# EAGLE design tqfp-sandwich (EAGLE 9.4.1)
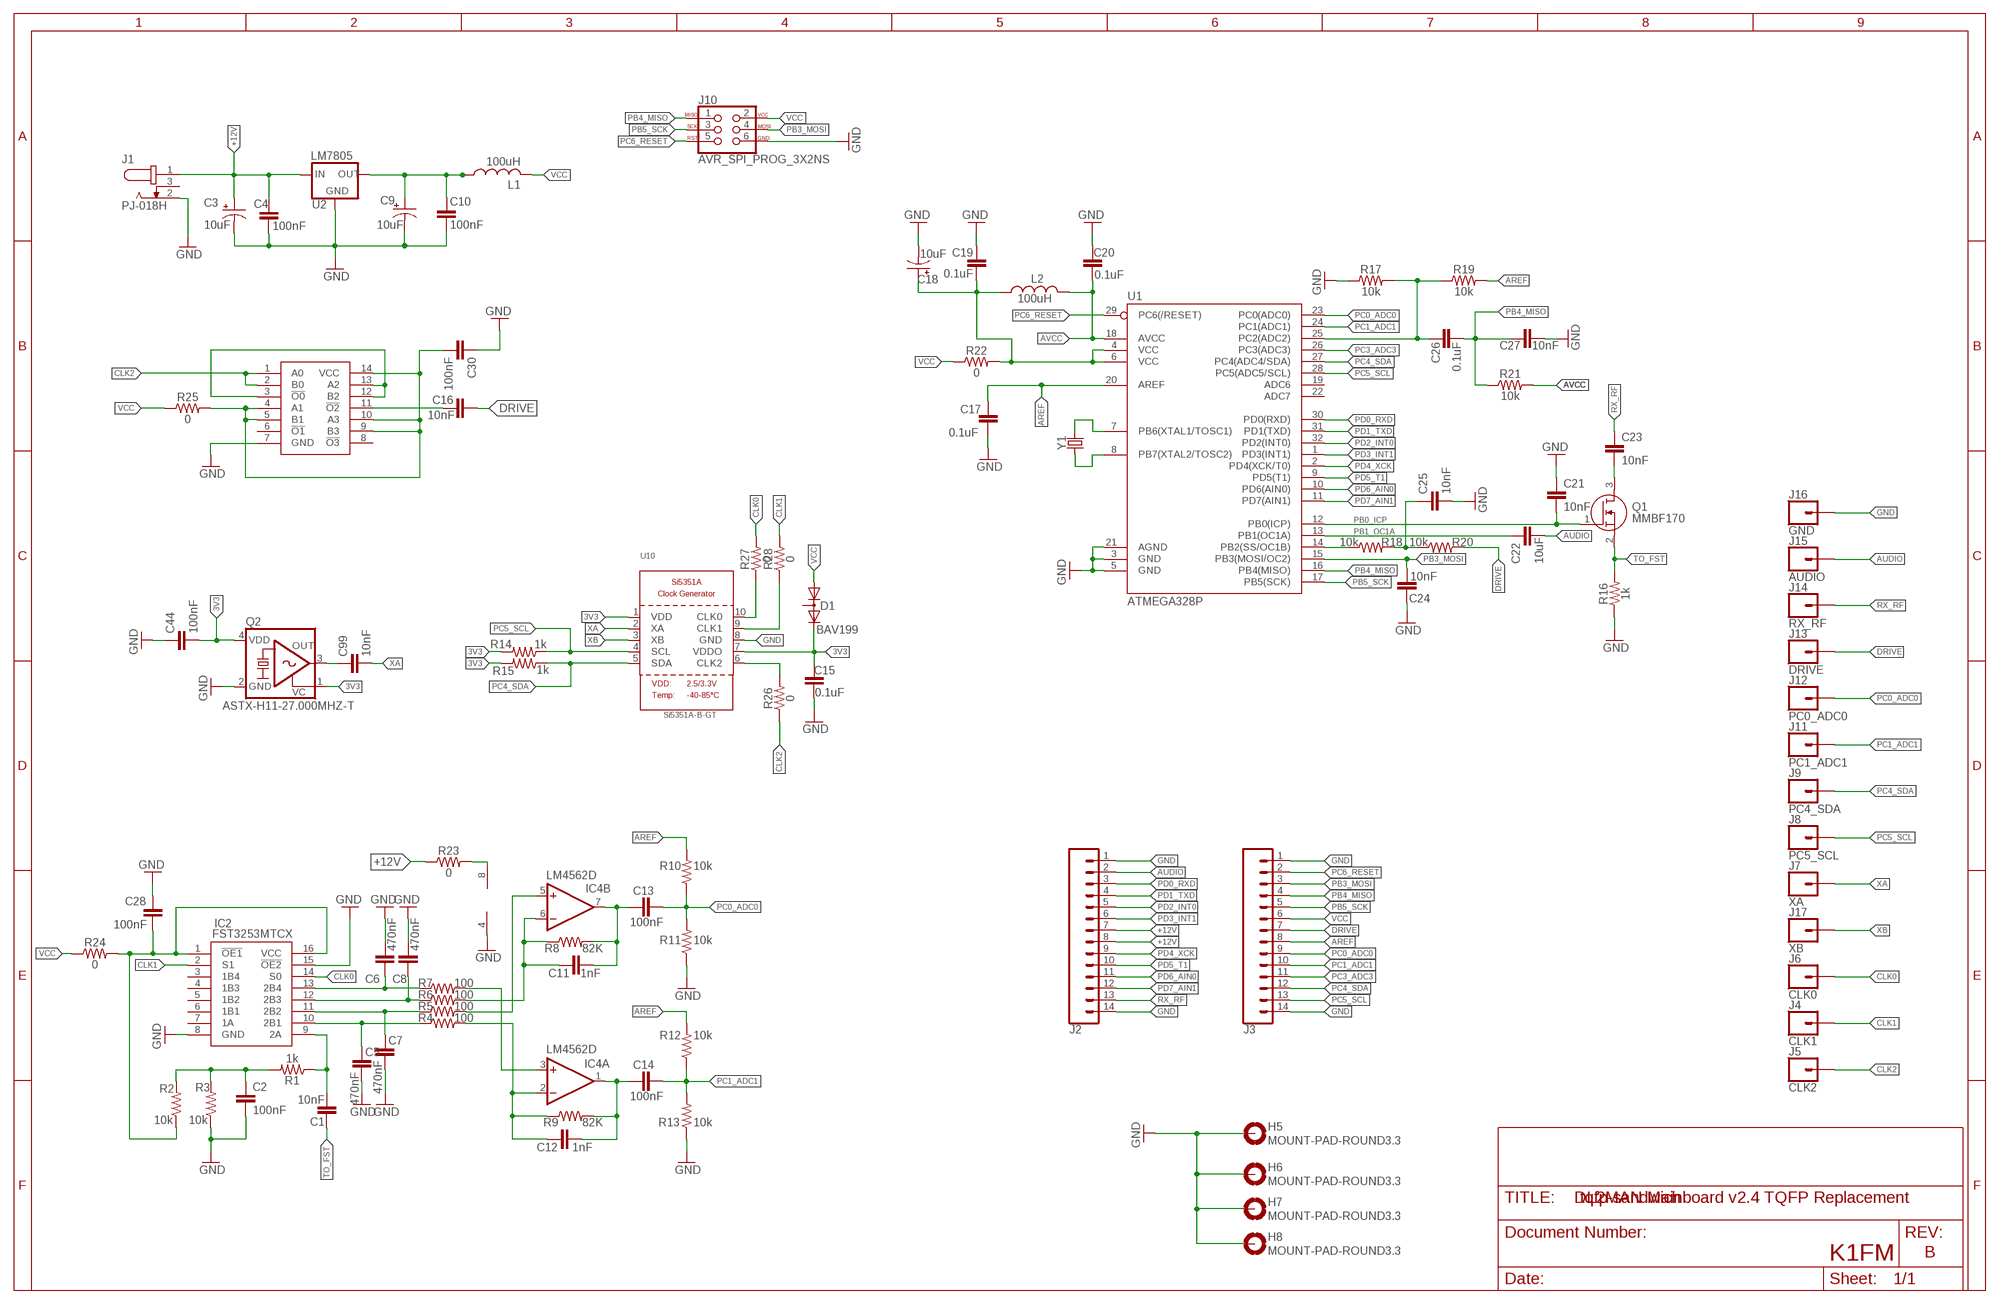
[diagram p0: schematic, sheet 1]

## Parts
C1  10nF  10NF-0603-50V-10%  [0603]
C2  100nF  10NF-0603-50V-10%  [0603]
C3  10uF  10UF-POLAR-EIA3216-16V-10%(TANT)  [EIA3216]
C4  100nF  10NF-0603-50V-10%  [0603]
C5  470nF  470PF-0603-50V-5%  [0603]
C6  470nF  470PF-0603-50V-5%  [0603]
C7  470nF  470PF-0603-50V-5%  [0603]
C8  470nF  470PF-0603-50V-5%  [0603]
C9  10uF  10UF-POLAR-EIA3216-16V-10%(TANT)  [EIA3216]
C10  100nF  10NF-0603-50V-10%  [0603]
C11  1nF  1.0NF/1000PF-0603-50V-10%  [0603]
C12  1nF  1.0NF/1000PF-0603-50V-10%  [0603]
C13  100nF  10NF-0603-50V-10%  [0603]
C14  100nF  10NF-0603-50V-10%  [0603]
C15  0.1uF  0.1UF-0603-25V-(+80/-20%)  [0603]
C16  10nF  10NF-0603-50V-10%  [0603]
C17  0.1uF  0.1UF-0603-25V-(+80/-20%)  [0603]
C18  10uF  10UF-POLAR-EIA3216-16V-10%(TANT)  [EIA3216]
C19  0.1uF  0.1UF-0603-25V-(+80/-20%)  [0603]
C20  0.1uF  0.1UF-0603-25V-(+80/-20%)  [0603]
C21  10nF  10NF-0603-50V-10%  [0603]
C22  10uF  10UF-0603-6.3V-20%  [0603]
C23  10nF  10NF-0603-50V-10%  [0603]
C24  10nF  10NF-0603-50V-10%  [0603]
C25  10nF  10NF-0603-50V-10%  [0603]
C26  0.1uF  0.1UF-0603-25V-(+80/-20%)  [0603]
C27  10nF  10NF-0603-50V-10%  [0603]
C28  100nF  10NF-0603-50V-10%  [0603]
C30  100nF  10NF-0603-50V-10%  [0603]
C44  100nF  10NF-0603-50V-10%  [0603]
C99  10nF  10NF-0603-50V-10%  [0603]
D1  BAV199  [SOT23]
H5  MOUNT-PAD-ROUND3.3  [3,3-PAD]
H6  MOUNT-PAD-ROUND3.3  [3,3-PAD]
H7  MOUNT-PAD-ROUND3.3  [3,3-PAD]
H8  MOUNT-PAD-ROUND3.3  [3,3-PAD]
IC2  FST3253MTCX  [SOP65P640X110-16N]
IC3  74ACT00MTC  [SOP65P640X120-14N]
IC4  LM4562D  [SO08]
J1  PJ-018H  [CUI_PJ-018H]
J2  CONN_14  [1X14]
J3  CONN_14  [1X14]
J4  CLK1  CONN_01PTH_LONGPAD  [1X01_LONGPAD]
J5  CLK2  CONN_01PTH_LONGPAD  [1X01_LONGPAD]
J6  CLK0  CONN_01PTH_LONGPAD  [1X01_LONGPAD]
J7  XA  CONN_01PTH_LONGPAD  [1X01_LONGPAD]
J8  PC5_SCL  CONN_01PTH_LONGPAD  [1X01_LONGPAD]
J9  PC4_SDA  CONN_01PTH_LONGPAD  [1X01_LONGPAD]
J10  AVR_SPI_PROG_3X2NS  [2X3-NS]
J11  PC1_ADC1  CONN_01PTH_LONGPAD  [1X01_LONGPAD]
J12  PC0_ADC0  CONN_01PTH_LONGPAD  [1X01_LONGPAD]
J13  DRIVE  CONN_01PTH_LONGPAD  [1X01_LONGPAD]
J14  RX_RF  CONN_01PTH_LONGPAD  [1X01_LONGPAD]
J15  AUDIO  CONN_01PTH_LONGPAD  [1X01_LONGPAD]
J16  GND  CONN_01PTH_LONGPAD  [1X01_LONGPAD]
J17  XB  CONN_01PTH_LONGPAD  [1X01_LONGPAD]
L1  100uH  INDUCTOR_0805_L  [RESC0805_L]
L2  100uH  INDUCTOR_0805_L  [RESC0805_L]
Q1  MMBF170  [SOT96P237X111-3N]
Q2  ASTX-H11-27.000MHZ-T  KXO-VCXO-SINE-84  [3.2X2.5_KXO-84]
R1  1k  1KOHM-0603-1/10W-1%  [0603]
R2  10k  10KOHM-0603-1/10W-1%  [0603]
R3  10k  10KOHM-0603-1/10W-1%  [0603]
R4  100  100OHM-0603-1/4W-5%  [0603]
R5  100  100OHM-0603-1/4W-5%  [0603]
R6  100  100OHM-0603-1/4W-5%  [0603]
R7  100  100OHM-0603-1/4W-5%  [0603]
R8  82K  82OHM-0603-1/10W-1%  [0603]
R9  82K  82OHM-0603-1/10W-1%  [0603]
R10  10k  10KOHM-0603-1/10W-1%  [0603]
R11  10k  10KOHM-0603-1/10W-1%  [0603]
R12  10k  10KOHM-0603-1/10W-1%  [0603]
R13  10k  10KOHM-0603-1/10W-1%  [0603]
R14  1k  1KOHM-0603-1/10W-1%  [0603]
R15  1k  1KOHM-0603-1/10W-1%  [0603]
R16  1k  1KOHM-0603-1/10W-1%  [0603]
R17  10k  10KOHM-0603-1/10W-1%  [0603]
R18  10k  10KOHM-0603-1/10W-1%  [0603]
R19  10k  10KOHM-0603-1/10W-1%  [0603]
R20  10k  10KOHM-0603-1/10W-1%  [0603]
R21  10k  10KOHM-0603-1/10W-1%  [0603]
R22  0  0OHM-0603-1/10W-5%  [0603]
R23  0  0OHM-0603-1/10W-5%  [0603]
R24  0  0OHM-0603-1/10W-5%  [0603]
R25  0  0OHM-0603-1/10W-5%  [0603]
R26  0  0OHM-0603-1/10W-5%  [0603]
R27  0  0OHM-0603-1/10W-5%  [0603]
R28  0  0OHM-0603-1/10W-5%  [0603]
U1  ATMEGA328P  ATMEGA328P_TQFP  [TQFP32-08]
U2  LM7805  V_REG_78XX7812  [TO-252]
U10  Si5351A-B-GT  SI5351A  [MSOP10]
Y1  CRYSTALSMD-5X3.2-2PAD  [CRYSTAL-SMD-5X3.2-2PAD]

## Nets
3V3: C15.2 C44.2 D1.2(C) Q2.1(VC) Q2.4(VDD) R14.2 R15.2 U10.1(VDD) U10.7(VDDO)
5V: C9.+ C10.2 L1.1 U2.2(OUT)
+12V: C3.+ C4.2 J1.1 J2.7 J2.8 R23.1 U2.1(IN)
AREF: C17.2 J3.8 R10.2 R12.2 R19.2 U1.20(AREF)
AUDIO: C22.2 J2.2 J15.1
AVCC: C20.1 L2.2 R21.2 U1.18(AVCC)
CLK0: IC2.14(S0) J6.1 R27.2
CLK1: IC2.2(S1) J4.1 R28.2
CLK2: IC3.1(A0) IC3.2(B0) J5.1 R26.1
DRIVE: C16.2 J3.7 J13.1 R20.2
GND: C2.2 C3.- C4.1 C5.2 C6.2 C7.2 C8.2 C9.- C10.1 C15.1 C17.1 C18.- C19.2 C20.2 C21.1 C24.1 C25.2 C27.2 C28.1 C30.1 C44.1 H5.B3,3(MOUNT) H6.B3,3(MOUNT) H7.B3,3(MOUNT) H8.B3,3(MOUNT) IC2.8(GND) IC2.15(!OE2) IC3.7(GND) IC4.4(P:V-) J1.2 J2.1 J2.14 J3.1 J3.14 J10.6 J16.1 Q2.2(GND) R3.1 R11.1 R13.1 R16.1 R17.1 U1.3(GND) U1.5(GND) U1.21(AGND) U2.3(GND) U10.8(GND)
N$1: U1.7(PB6(XTAL1/TOSC1)) Y1.P$2
N$2: U1.8(PB7(XTAL2/TOSC2)) Y1.P$1
N$3: C23.2 Q1.3(D)
N$4: C26.2 R17.2 R19.1 U1.25(PC2(ADC2))
N$5: IC3.3(!O0) IC3.12(B2) IC3.13(A2)
N$6: R18.1 U1.14(PB2(SS/OC1B))
N$7: C25.1 R18.2 R20.1
N$8: C99.1 Q2.3(OUT)
N$9: C5.1 IC2.10(2B1) R4.1
N$10: C16.1 IC3.11(!O2)
N$11: C18.+ C19.1 L2.1 R22.2 U1.4(VCC) U1.6(VCC)
N$12: C1.2 IC2.9(2A) R1.1
N$13: C2.1 R1.2 R2.2 R3.2
N$14: C7.1 IC2.11(2B2) R5.1
N$15: C8.1 IC2.12(2B3) R6.1
N$16: C6.1 IC2.13(2B4) R7.1
N$17: IC4.5(B:+IN) R5.2
N$18: C12.1 IC4.2(A:-IN) R4.2 R9.1
N$19: C11.1 IC4.6(B:-IN) R6.2 R8.1
N$20: IC4.3(A:+IN) R7.2
N$21: C11.2 C13.1 IC4.7(B:OUT) R8.2
N$22: C12.2 C14.1 IC4.1(A:OUT) R9.2
N$23: IC4.8(P:V+) R23.2
N$24: C28.2 IC2.1(!OE1) IC2.16(VCC) R2.1 R24.2
N$25: C30.2 IC3.4(A1) IC3.5(B1) IC3.9(B3) IC3.10(A3) IC3.14(VCC) R25.2
N$26: R27.1 U10.10(CLK0)
N$27: R28.1 U10.9(CLK1)
N$28: R26.2 U10.6(CLK2)
PB0_ICP: C21.2 Q1.1(G) U1.12(PB0(ICP))
PB1_OC1A: C22.1 U1.13(PB1(OC1A))
PB3_MOSI: C24.2 J3.3 J10.4 U1.15(PB3(MOSI/OC2))
PB4_MISO: C26.1 C27.1 J3.4 J10.1 R21.1 U1.16(PB4(MISO))
PB5_SCK: J3.5 J10.3 U1.17(PB5(SCK))
PC0_ADC0: C13.2 J3.9 J12.1 R10.1 R11.2 U1.23(PC0(ADC0))
PC1_ADC1: C14.2 J3.10 J11.1 R12.1 R13.2 U1.24(PC1(ADC1))
PC3_ADC3: J3.11 U1.26(PC3(ADC3))
PC4_SDA: J3.12 J9.1 R15.1 U1.27(PC4(ADC4/SDA)) U10.5(SDA)
PC5_SCL: J3.13 J8.1 R14.1 U1.28(PC5(ADC5/SCL)) U10.4(SCL)
PC6_RESET: J3.2 J10.5 U1.29(PC6(/RESET))
PD0_RXD: J2.3 U1.30(PD0(RXD))
PD1_TXD: J2.4 U1.31(PD1(TXD))
PD2_INT0: J2.5 U1.32(PD2(INT0))
PD3_INT1: J2.6 U1.1(PD3(INT1))
PD4_XCK: J2.9 U1.2(PD4(XCK/T0))
PD5_T1: J2.10 U1.9(PD5(T1))
PD6_AIN0: J2.11 U1.10(PD6(AIN0))
PD7_AIN1: J2.12 U1.11(PD7(AIN1))
RX_RF: C23.1 J2.13 J14.1
TO_FST: C1.1 Q1.2(S) R16.2
VCC: D1.1(A) J3.6 J10.2 L1.2 R22.1 R24.1 R25.1
XA: C99.2 J7.1 U10.2(XA)
XB: J17.1 U10.3(XB)
Unconnected: D1.3(AC) IC2.3(1B4) IC2.4(1B3) IC2.5(1B2) IC2.6(1B1) IC2.7(1A) IC3.6(!O1) IC3.8(!O3) J1.3 U1.19(ADC6) U1.22(ADC7)

## Notes on the sheet
- DL2MAN Mainboard v2.4 TQFP Replacement
- K1FM | B

## Library data of the parts
C1 C16 C21 C23-C25 C27 C99 = SparkFun-Capacitors:10NF: 0.01uF/10nF/10,000pF ceramic capacitors A capacitor is a passive two-terminal electrical component used to store electrical energy temporarily in an electric field. CAP-09321; PROD_ID: CAP-00867
C2 C4 C10 C13 C14 C28 C30 C44 = SparkFun-Capacitors:10NF: 0.01uF/10nF/10,000pF ceramic capacitors A capacitor is a passive two-terminal electrical component used to store electrical energy temporarily in an electric field. CAP-09321; PROD_ID: CAP-00867; VALUE: 10nF
C3 C9 C18 = SparkFun-Capacitors:10UF-POLAR: 10.0µF polarized capacitors A capacitor is a passive two-terminal electrical component used to store electrical energy temporarily in an electric field.; PROD_ID: CAP-00811
C5-C8 = SparkFun-Capacitors:470PF: 470pF ceramic capacitors A capacitor is a passive two-terminal electrical component used to store electrical energy temporarily in an electric field.; PROD_ID: CAP-07884; VALUE: 470pF
C11 C12 = SparkFun-Capacitors:1.0NF/1000PF: 1nF/1,000pF ceramic capacitors A capacitor is a passive two-terminal electrical component used to store electrical energy temporarily in an electric field.; PROD_ID: CAP-07886
C15 C17 C19 C20 C26 = SparkFun-Capacitors:0.1UF: 0.1µF ceramic capacitors A capacitor is a passive two-terminal electrical component used to store electrical energy temporarily in an electric field.; PROD_ID: CAP-00810
C22 = SparkFun-Capacitors:10UF: 10.0µF ceramic capacitors A capacitor is a passive two-terminal electrical component used to store electrical energy temporarily in an electric field.; PROD_ID: CAP-11015
D1 = diode:BAV199: DIODE low-leakage double diode
H5-H8 = holes:MOUNT-PAD-ROUND: MOUNTING PAD, round
IC2 = FST3253MTCX:FST3253MTCX: IC, Fairchild, FST3253MTCX Fairchild Semiconductor FST3253MTCX, Multiplexer/Demultiplexer Dual 4:1 Multiplexer, 4 5.5 V, 16-Pin TSSOP Source: Datasheet <https://componentsearchengine.com/Datasheets/2/FST3253MTCX.pdf>; DESCRIPTION: IC, Fairchild, FST3253MTCX Fairchild Semiconductor FST3253MTCX, Multiplexer/Demultiplexer Dual 4:1 Multiplexer, 4 5.5 V, 16-Pin TSSOP; HEIGHT: 1.1mm; MANUFACTURER_NAME: ON Semiconductor; MANUFACTURER_PART_NUMBER: FST3253MTCX; MOUSER_PART_NUMBER: 512-FST3253MTCX; MOUSER_PRICE-STOCK: https://www.mouser.co.uk/ProductDetail/ON-Semiconductor-Fairchild/FST3253MTCX?qs=9%2FFjV4%2Fi8eqnAjRVZNaJgw%3D%3D
IC3 = 74ACT00MTC:74ACT00MTC: Fairchild Semiconductor 74ACT00MTC, NAND Quad 2 Input NAND, 4.5 5.5 V, 14-Pin TSSOP Source: Datasheet <https://componentsearchengine.com/Datasheets/1/74ACT00MTC.pdf>; DESCRIPTION: Fairchild Semiconductor 74ACT00MTC, NAND Quad 2 Input NAND, 4.5 5.5 V, 14-Pin TSSOP; HEIGHT: 1.2mm; MANUFACTURER_NAME: ON Semiconductor; MANUFACTURER_PART_NUMBER: 74ACT00MTC; MOUSER_PART_NUMBER: 512-74ACT00MTC; MOUSER_PRICE-STOCK: https://www.mouser.com/Search/Refine.aspx?Keyword=512-74ACT00MTC
IC4 = LM4562:LM4562: OP AMP also LM158; LM258; LM2904 Source: http://cache.national.com/ds/LM/LM158.pdf
J1 = PJ-018H:PJ-018H: 1.65 mm Center Pin, 3.5 A, Right Angle, Through Hole, Dc Power Jack Connector; MANUFACTURER: CUI INC; STANDARD: Manufacturer recommendations
J2 J3 = SparkFun-Connectors:CONN_14: Multi connection point. Often used as Generic Header-pin footprint for 0.1 inch spaced/style header connections On any of the 0.1 inch spaced packages, you can populate with these: Break Away Headers - Straight <https://www.sparkfun.com/products/116> (PRT-00116) Break Away Male Headers - Right Angle <https://www.sparkfun.com/products/553> (PRT-00553) Female Headers <https://www.sparkfun.com/products/115> (PRT-00115) Break Away Headers - Machine Pin <https://www.sparkfun.com/products/117> (PRT-00117) Break Away Female Headers - Swiss Machine Pin <https://www.sparkfun.com/products/743> (PRT-00743) For SCREWTERMINALS and SPRING TERMINALS visit here: Screw Terimnals on SparkFun.com <https://www.sparkfun.com/search/results?term=Screw+Terminals> (5mm/3.5mm/2.54mm spacing) This device is also useful as a general connection point to wire up your design to another part of your project. Our various solder wires solder well into these plated through hole pads. Hook-Up Wire - Assortment (Stranded, 22 AWG) <https://www.sparkfun.com/products/11375> (PRT-11375) Hook-Up Wire - Assortment (Solid Core, 22 AWG) <https://www.sparkfun.com/products/11367> (PRT-11367) View the entire wire category on our website here <https://www.sparkfun.com/categories/141> Special notes: Molex polarized connector foot print use with SKU : PRT-08231 with associated crimp pins and housings. 1MM SMD Version SKU: PRT-10208 NOTES ON THE VARIANTS LOCK and LOCK_LONGPADS... This footprint was designed to help hold the alignment of a through-hole component (i.e. 6-pin header) while soldering it into place. You may notice that each hole has been shifted either up or down by 0.005 of an inch from it's more standard position (which is a perfectly straight line). This slight alteration caused the pins (the squares in the middle) to touch the edges of the holes. Because they are alternating, it causes a "brace" to hold the component in place. 0.005 has proven to be the perfect amount of "off-center" position when using our standard breakaway headers. Although looks a little odd when you look at the bare footprint, once you have a header in there, the alteration is very hard to notice. Also,if you push a header all the way into place, it is covered up entirely on the bottom side.
J4-J9 J11-J17 = SparkFun-Connectors:CONN_01: Single connection point. Often used as Generic Header-pin footprint for 0.1 inch spaced/style header connections On any of the 0.1 inch spaced packages, you can populate with these: Break Away Headers - Straight <https://www.sparkfun.com/products/116> (PRT-00116) Break Away Male Headers - Right Angle <https://www.sparkfun.com/products/553> (PRT-00553) Female Headers <https://www.sparkfun.com/products/115> (PRT-00115) Break Away Headers - Machine Pin <https://www.sparkfun.com/products/117> (PRT-00117) Break Away Female Headers - Swiss Machine Pin <https://www.sparkfun.com/products/743> (PRT-00743) This device is also useful as a general connection point to wire up your design to another part of your project. Our various solder wires solder well into these plated through hole pads. Hook-Up Wire - Assortment (Stranded, 22 AWG) <https://www.sparkfun.com/products/11375> (PRT-11375) Hook-Up Wire - Assortment (Solid Core, 22 AWG) <https://www.sparkfun.com/products/11367> (PRT-11367) View the entire wire category on our website here <https://www.sparkfun.com/categories/141> Special notes: SMTSO-256-ET is a "flush mount" nut for a 4-40 screw. We mostly use this on specialty testbeds; it is a nice way to connect hardware to your PCB at an adjustable hieght. Also note, the SNAP packages are for using a snappable style connector. We sell a baggie of snaps and they are also used on two LilyPad designs: Snap Assortment - 30 pack (male and female) <https://www.sparkfun.com/products/11347> (DEV-11347) LilyPad Arduino SimpleSnap <https://www.sparkfun.com/products/10941> (DEV-10941) LilyPad SimpleSnap Protoboard <https://www.sparkfun.com/products/10940> (DEV-10940)
J10 = SparkFun-Connectors:AVR_SPI_PROG_3X2: AVR ISP 6 Pin This is the reduced ISP connector for AVR programming. Common on Arduino. This footprint will take up less PCB space and can be used with a 10-pin to 6-pin adapter such as SKU: BOB-08508 **Special note about "TEST_POINT" package. The stop mask is on the top side, so if you want your programming test points to be on the bottom of your board, make sure to place this package on the bottom side of the board. This also ensure that the orientation to program from the bottom side will be correct. SparkFun Products: SparkFun ISP Pogo Adapter <https://www.sparkfun.com/products/11591> - NS Tiny AVR Programmer <https://www.sparkfun.com/products/11801> -PTH
L1 L2 = Nordic_nRF:INDUCTOR: Generic chip inductor
Q1 = MMBF170:MMBF170: MMBF170 N-Channel MOSFET, 500 mA, 60 V, 3-Pin SOT-23 ON Semiconductor Source: Datasheet <https://www.onsemi.com/pub/Collateral/MMBF170-D.PDF>; DESCRIPTION: MMBF170 N-Channel MOSFET, 500 mA, 60 V, 3-Pin SOT-23 ON Semiconductor; HEIGHT: 1.11mm; MANUFACTURER_NAME: ON Semiconductor; MANUFACTURER_PART_NUMBER: MMBF170; MOUSER_PART_NUMBER: 512-MMBF170; MOUSER_PRICE-STOCK: https://www.mouser.co.uk/ProductDetail/ON-Semiconductor-Fairchild/MMBF170?qs=FOlmdCx%252BAA2suHItufvdcg%3D%3D
Q2 = crystal-geyer_V1_0:KXO-VCXO-SINE: VCXO : Sinewave - Serie Model Size l/w/h [mm] Frequency Range Frequency Stability Temp. Range [°C] Output AECQ 200 availabel Datasheet KXO-81 KXO-86 KXO-84 KXO-83 KXO-82 2.0/1.6/0.7 2.5/2.0/0.7 3.2/2.5/1.0 5.0/3.2/1.5 7.0/5.0/2.0 13,0 ~ 40,0 MHz 13,0 ~ 40,0 MHz 10,0 ~ 26,0 MHz 12,0 ~ 26,0 MHz 12,6 ~ 20,0 MHz ±10 … ±50ppm ±10 … ±50ppm ±10 … ±50ppm ±10 … ±50ppm ±10 … ±50ppm (*) -30°C …+75°C (*) -30°C …+75°C (*) -40°C …+85°C (*) -40°C …+85°C (*) -30°C …+80°C Sinewave Sinewave Sinewave Sinewave Sinewave - - - - - KXO-81.pdf <http://www.geyer-electronic.de/uploads/tx_userartikelfrequenz/GEYER-KXO-81-VCXO-sinewave.pdf> KXO-86.pdf <http://www.geyer-electronic.de/uploads/tx_userartikelfrequenz/GEYER-KXO-86-VCXO-sinewave.pdf> KXO-84.pdf <http://www.geyer-electronic.de/uploads/tx_userartikelfrequenz/GEYER-KXO-84-VCXO-sinewave.pdf> KXO-83.pdf <http://www.geyer-electronic.de/uploads/tx_userartikelfrequenz/GEYER-KXO-83-VCXO-sinewave.pdf> KXO-82.pdf <http://www.geyer-electronic.de/uploads/tx_userartikelfrequenz/GEYER-KXO-82-VCXO-sinewave.pdf> <http://www.geyer-electronic.de/fileadmin/template/img/logo-geyer-electronic.png> Details see: http://www.geyer-electronic.de/Frequenz-Produkte.9.0.html Created 2016-06-07, Hans Locher 2016 (C) Geyer Quartz Technology KXO81,KXO86,KXO84,KXO83,KXO82,2,0x1,6;2.0x1.6;2,5x2,0;2.5x2.0;3,2x2,5;3.2x2.5;5,0x3,2;5.0x3.2;7,0x5,0;7.0x5.0;2016;2520;3225;5032;7050
R1 R14-R16 = SparkFun-Resistors:1KOHM: 1kΩ resistor A resistor is a passive two-terminal electrical component that implements electrical resistance as a circuit element. Resistors act to reduce current flow, and, at the same time, act to lower voltage levels within circuits. - Wikipedia; PROD_ID: RES-07856
R2 R3 R10-R13 R17-R21 = SparkFun-Resistors:10KOHM: 10kΩ resistor A resistor is a passive two-terminal electrical component that implements electrical resistance as a circuit element. Resistors act to reduce current flow, and, at the same time, act to lower voltage levels within circuits. - Wikipedia; PROD_ID: RES-00824
R4-R7 = SparkFun-Resistors:100OHM: 100Ω resistor A resistor is a passive two-terminal electrical component that implements electrical resistance as a circuit element. Resistors act to reduce current flow, and, at the same time, act to lower voltage levels within circuits. - Wikipedia; PROD_ID: RES-12438
R8 R9 = SparkFun-Resistors:82OHM: 82Ω resistor A resistor is a passive two-terminal electrical component that implements electrical resistance as a circuit element. Resistors act to reduce current flow, and, at the same time, act to lower voltage levels within circuits. - Wikipedia; PROD_ID: RES-12311; VALUE: 82
R22-R28 = SparkFun-Resistors:0OHM: 0Ω resistor A resistor is a passive two-terminal electrical component that implements electrical resistance as a circuit element. Resistors act to reduce current flow, and, at the same time, act to lower voltage levels within circuits. - Wikipedia; PROD_ID: RES-08609
U1 = SparkFun-IC-Microcontroller:ATMEGA328P_TQFP: Popular 328P in QFP Storefront component: ATmega328 - TQFP <https://www.sparkfun.com/products/13448> (COM-13448) Datasheet <http://www.sparkfun.com/datasheets/Components/SMD/ATMega328.pdf> SparkFun Products SparkFun RedBoard - Programmed with Arduino <https://www.sparkfun.com/products/12757> (DEV-12757) Arduino Pro Mini 328 - 5V/16MHz <https://www.sparkfun.com/products/11113> (DEV-11113) Arduino Pro Mini 328 - 3.3V/8MHz <https://www.sparkfun.com/products/11114> (DEV-11114) SparkFun OpenLog <https://www.sparkfun.com/products/13712> (DEV-13712) SparkFun MicroView - OLED Arduino Module <https://www.sparkfun.com/products/12923> (DEV-12923) SparkFun Digital Sandbox <https://www.sparkfun.com/products/12651> (DEV-12651) SparkFun PicoBoard <https://www.sparkfun.com/products/11888> (WIG-11888) Arduino Fio <https://www.sparkfun.com/products/10116> (DEV-10116) LilyPad Arduino 328 Main Board <https://www.sparkfun.com/products/13342> (DEV-13342) SparkFun RedStick <https://www.sparkfun.com/products/13741> (DEV-13741) LilyPad MP3 <https://www.sparkfun.com/products/11013> (DEV-11013) LilyPad Arduino SimpleSnap <https://www.sparkfun.com/products/10941> (DEV-10941) SparkFun Stepoko <https://www.sparkfun.com/products/13899> (ROB-13899) SparkFun Geiger Counter <https://www.sparkfun.com/products/11345> (SEN-11345) SparkFun EL Sequencer <https://www.sparkfun.com/products/12781> (COM-12781) Arduino Pro 328 - 5V/16MHz <https://www.sparkfun.com/products/10915> (DEV-10915) CryptoCape <https://www.sparkfun.com/products/12773> (DEV-12773) SparkFun IR Thermometer Evaluation Board - MLX90614 <https://www.sparkfun.com/products/10740> (SEN-10740) SparkFun RedBot Mainboard <https://www.sparkfun.com/products/12097> (ROB-12097) Arduino Pro 328 - 3.3V/8MHz <https://www.sparkfun.com/products/10914> (DEV-10914) SparkFun Block for Intel® Edison - Arduino <https://www.sparkfun.com/products/13036> (DEV-13036) SparkFun Simon Says - Surface Mount Soldering Kit <https://www.sparkfun.com/products/10935> (KIT-10935) SparkFun 7-Segment Serial Display - Red <https://www.sparkfun.com/products/11441> (COM-11441) SparkFun 7-Segment Serial Display - White <https://www.sparkfun.com/products/11629> (COM-11629) SparkFun 7-Segment Serial Display - Yellow <https://www.sparkfun.com/products/11443> (COM-11443) SparkFun 7-Segment Serial Display - Kelly Green <https://www.sparkfun.com/products/11440> (COM-11440) SparkFun 7-Segment Serial Display - Blue <https://www.sparkfun.com/products/11442> (COM-11442) SparkFun OpenSegment Serial Display - 20mm (Blue) <https://www.sparkfun.com/products/11647> (COM-11647) SparkFun OpenSegment Serial Display - 20mm (Green) <https://www.sparkfun.com/products/11646> (COM-11646) SparkFun OpenSegment Serial Display - 20mm (White) <https://www.sparkfun.com/products/11648> (COM-11648) SparkFun OpenSegment Serial Display - 20mm (Red) <https://www.sparkfun.com/products/11644> (COM-11644) SparkFun OpenSegment Serial Display - 20mm (Yellow) <https://www.sparkfun.com/products/11645> (COM-11645) SparkFun OpenSegment Shield <https://www.sparkfun.com/products/13190> (DEV-13190); PROD_ID: IC-09069; VALUE: ATMEGA328P_TQFP
U2 = SparkFun-IC-Power:V_REG_78XX: Voltage Regulator Standard 78xx regulator. IGO (Input Ground Output). Spark Fun Electronics SKU : COM-00107; PROD_ID: VREG-12370; VALUE: +12v
U10 = microbuilder:SI5351A: Si5351A 8kHz-160MHz I2C Clock Generator VDD: 2.5V or 3.3V Input Range: 25MHz or 27MHz XTAL User selectable internal input load capacitors: 6, 8 or 10 pF Output Impedance: 85 Ohm Output Load Capacitance: 5-15pF Operating Temperature: -40°C - 85°C Operating Current (3 outputs): 35mA Output buffer voltage (VDDO): 1.8, 2.5 or 3.3V Note: If VDDO is not used it should be connected to VDD. Unused clock out pins should be left floating.
Y1 = SparkFun-Clocks:CRYSTAL: Crystals (Generic) These are passive quartz crystals, which can be used as a clock source for a microcontroller. Crystal's are two-terminal devices. They require external "load" capacitors to generate an oscillating signal.

## Net classes
1 larger: width 0.406 mm, drill 0.35 mm

## Board
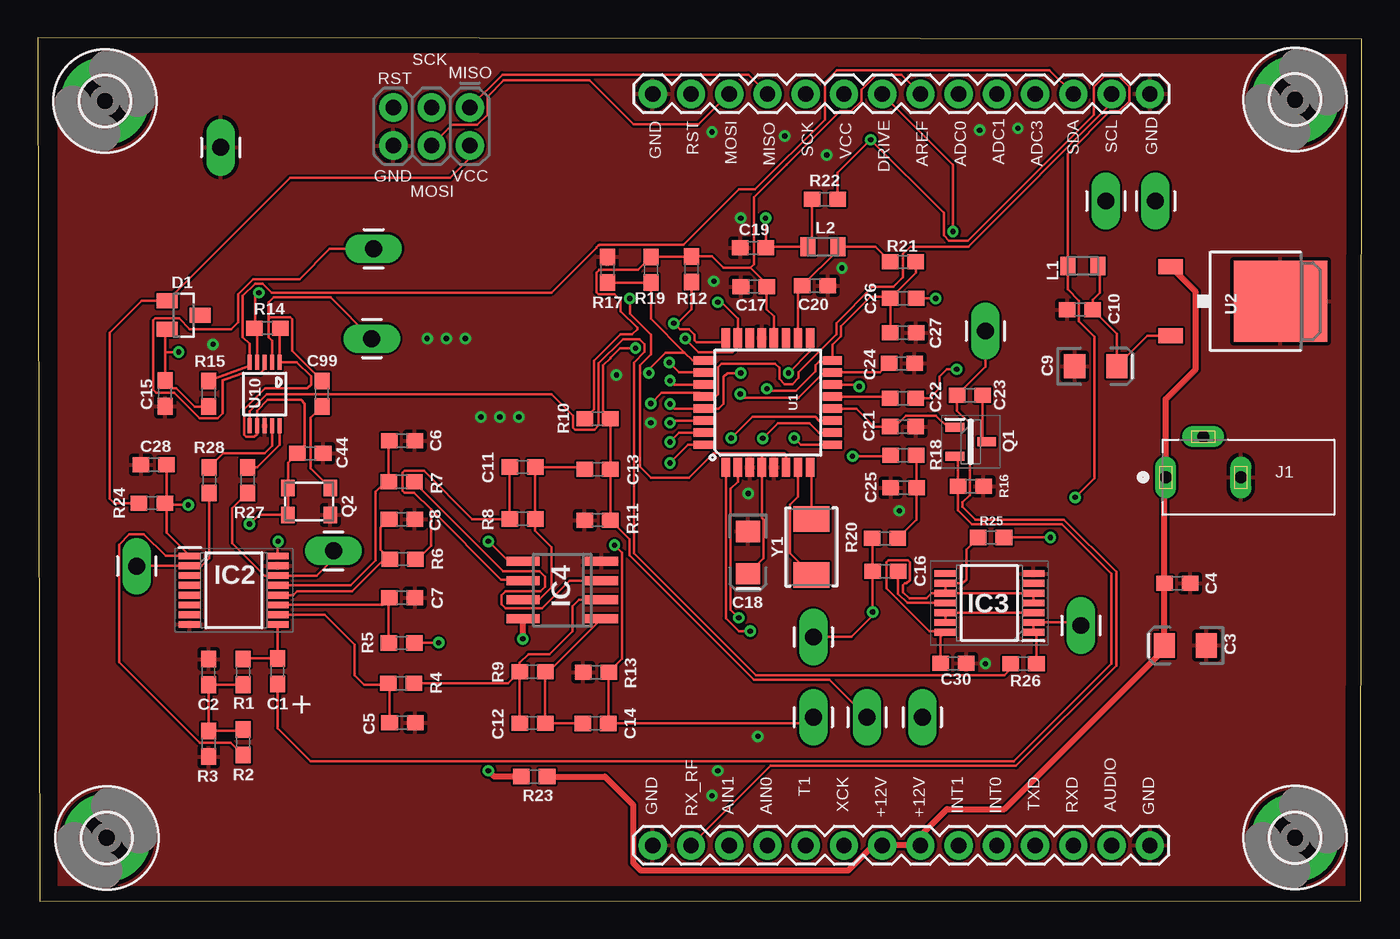
[diagram p1: board, top side]
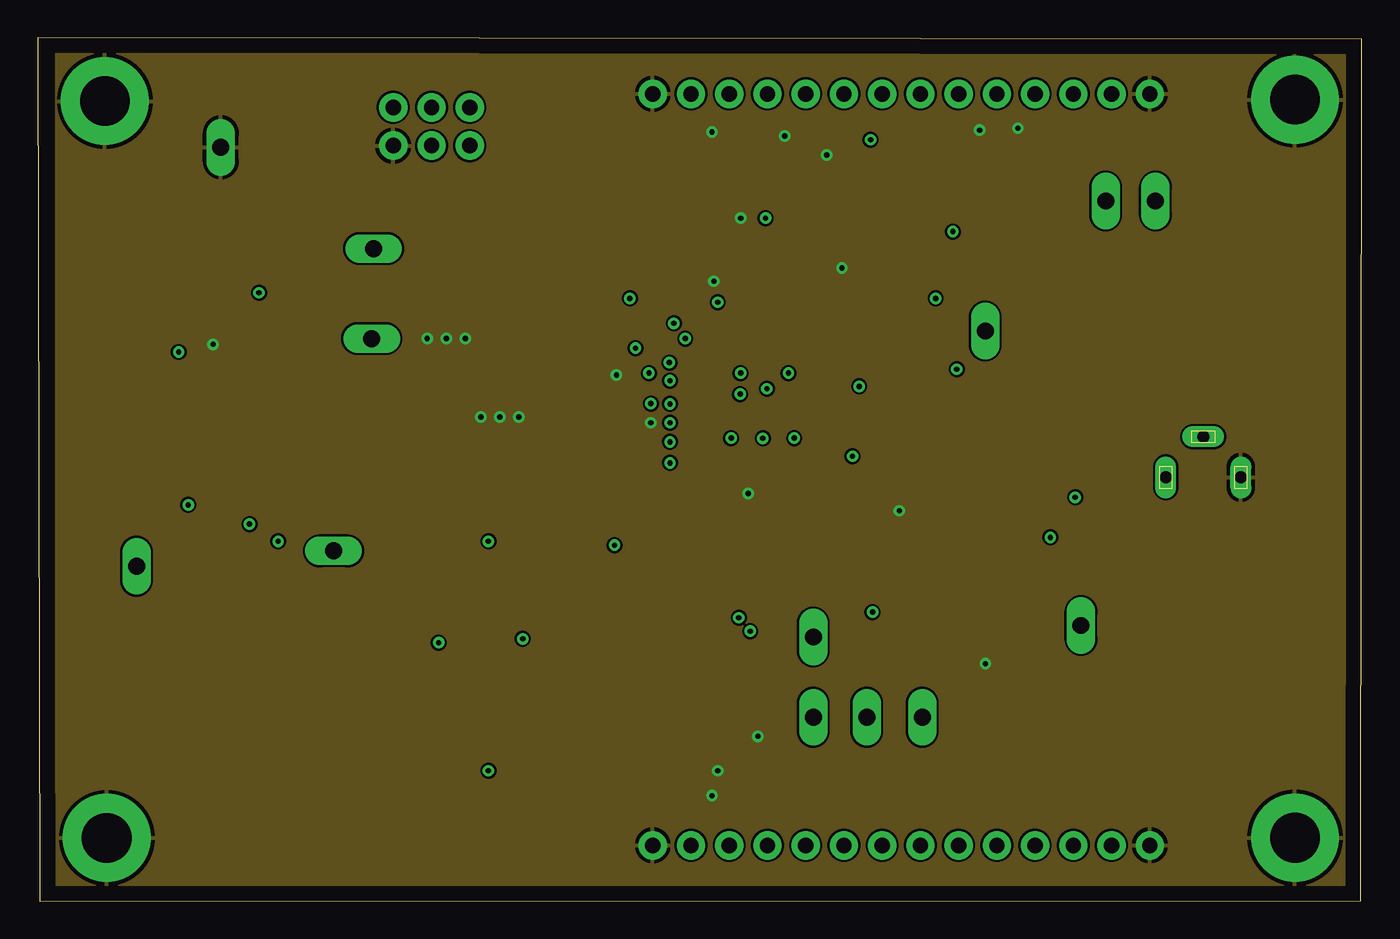
[diagram p2: board, inner layer Route2]
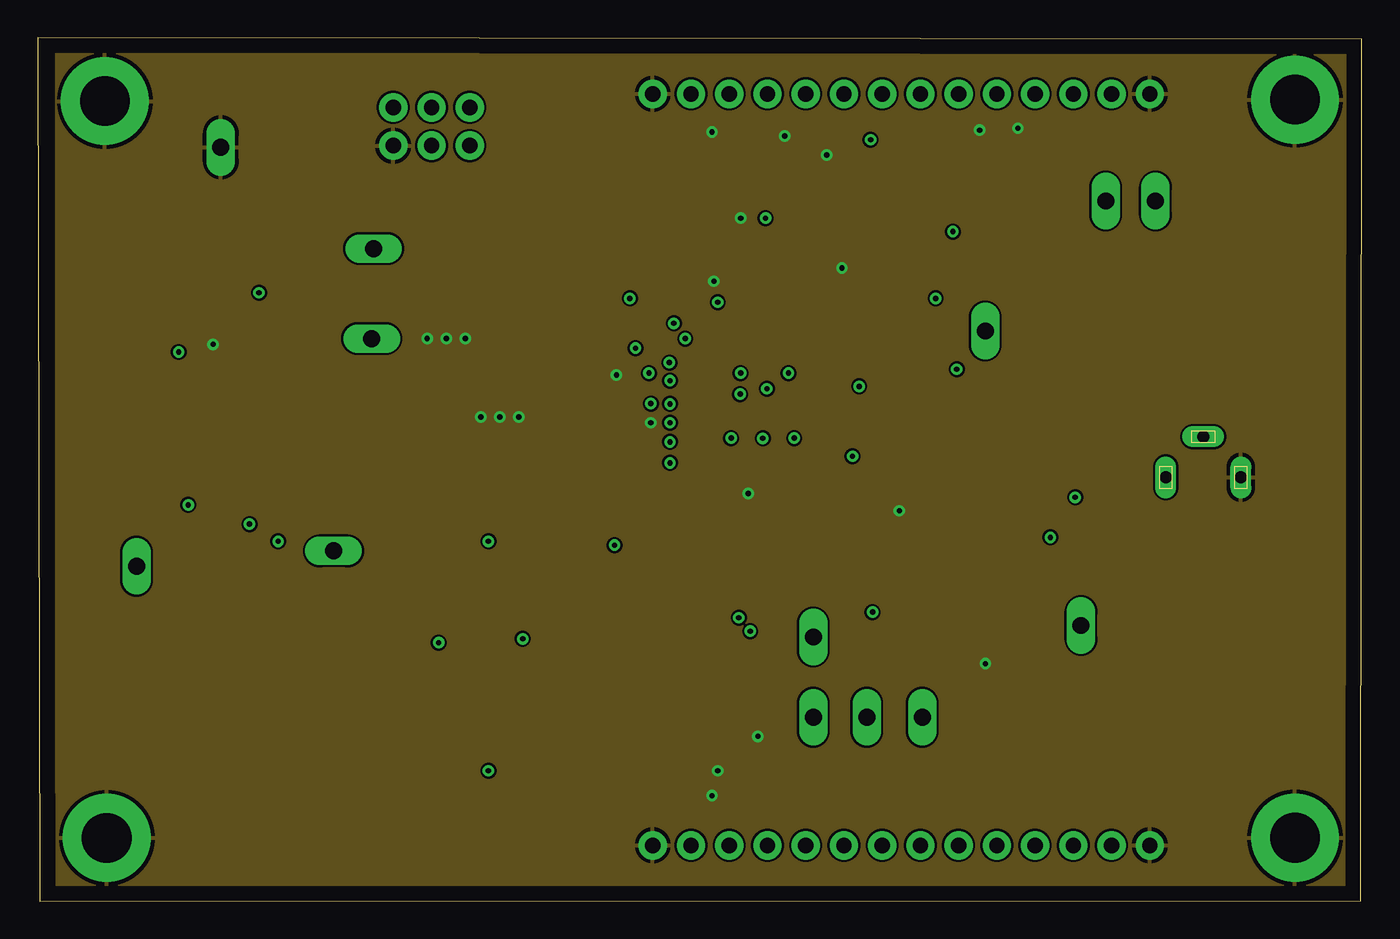
[diagram p3: board, inner layer Route15]
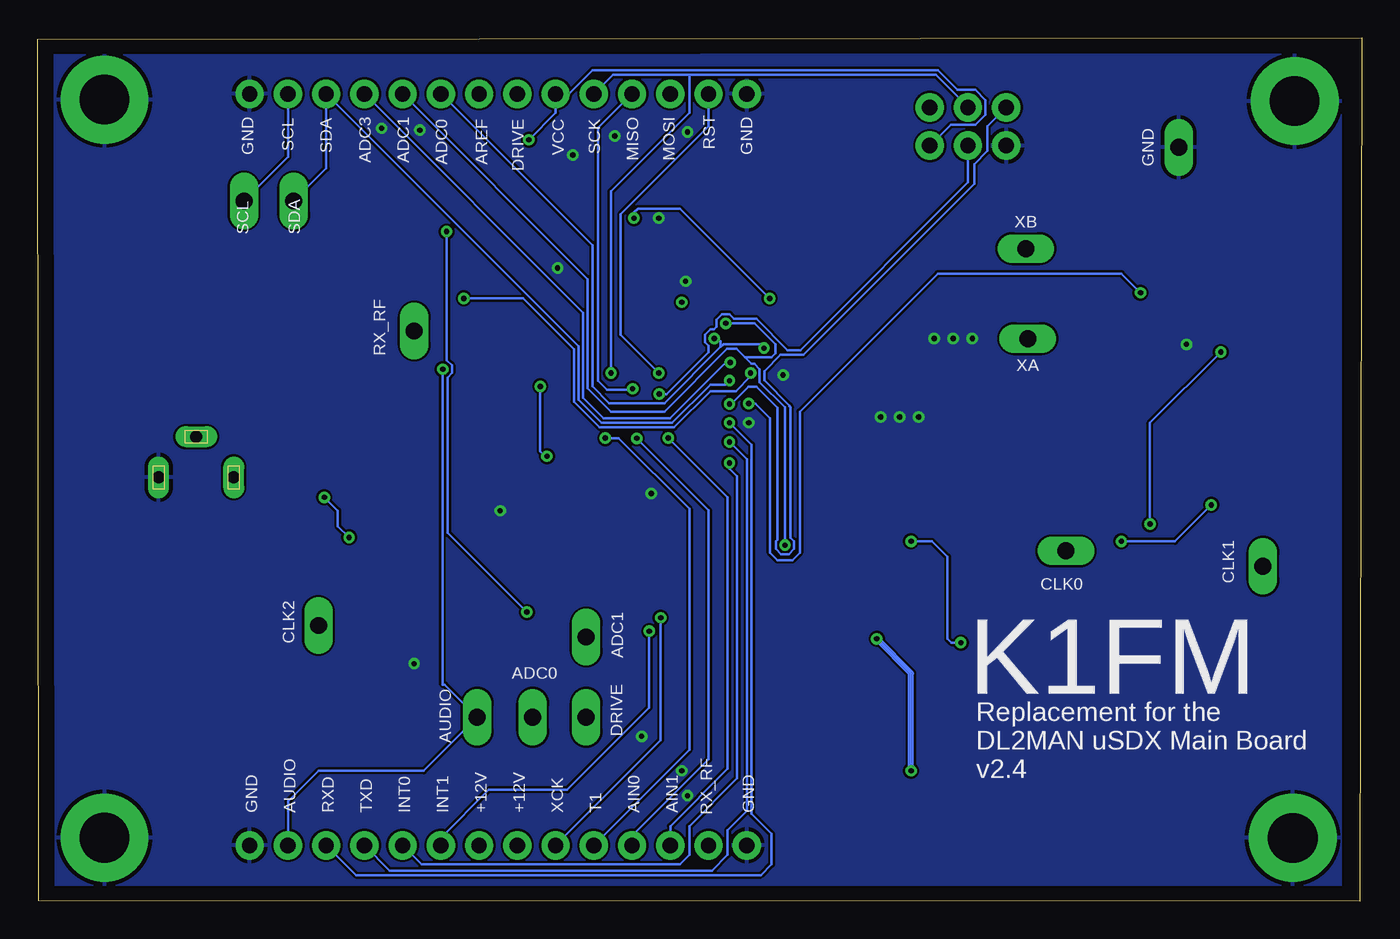
[diagram p4: board, bottom side, seen from below]

Size 87.98 x 57.36 mm. Coordinates in mm from the lower left corner, seen from the top.
Outline: 0.15,0 87.91,0.04 87.98,57.25 0,57.36 0.15,0
Copper layers (1*16): Top 0.035mm / dielectric 1.5mm / Bottom 0.035mm
Design rules "default *": minimum track width 6mil, minimum drill 0.35mm, track to track 6mil, track to pad 6mil, pad to pad 6mil, via to via 6mil, smd to smd 6mil, copper to edge 40mil, drill to drill 6mil, minimum pad ring 10mil, minimum via ring 8mil, stop-mask expansion 4mil, vias tented up to drill 0mil, thermal gap 10mil

### Footprints (pad centres in the part's own frame; a part is rotated, then mirrored left to right if it is on the bottom)
0603 = smd 1.1 x 1: 1 -0.85,0; 2 0.85,0
EIA3216 = smd 1.4 x 1.6: + 1.4,0; - -1.4,0
SOT23 = smd 1 x 1.4: 1 -0.95,-1.1; 2 0.95,-1.1; 3 0,1.1
3,3-PAD = drill 3.3 pad 5.842: B3,3 0,0
SOP65P640X110-16N = smd 1.45 x 0.45: 1 -2.925,2.275; 2 -2.925,1.625; 3 -2.925,0.975; 4 -2.925,0.325; 5 -2.925,-0.325; 6 -2.925,-0.975; 7 -2.925,-1.625; 8 -2.925,-2.275; 9 2.925,-2.275; 10 2.925,-1.625; 11 2.925,-0.975; 12 2.925,-0.325; 13 2.925,0.325; 14 2.925,0.975; 15 2.925,1.625; 16 2.925,2.275
SOP65P640X120-14N = smd 1.45 x 0.45: 1 -2.925,1.95; 2 -2.925,1.3; 3 -2.925,0.65; 4 -2.925,0; 5 -2.925,-0.65; 6 -2.925,-1.3; 7 -2.925,-1.95; 8 2.925,-1.95; 9 2.925,-1.3; 10 2.925,-0.65; 11 2.925,0; 12 2.925,0.65; 13 2.925,1.3; 14 2.925,1.95
SO08 = smd 0.6 x 2.2: 1 -1.905,-2.6; 2 -0.635,-2.6; 3 0.635,-2.6; 4 1.905,-2.6; 5 1.905,2.6; 6 0.635,2.6; 7 -0.635,2.6; 8 -1.905,2.6
CUI_PJ-018H = drill 0.8 pad 1.4 long: 1 0,0; 2 5,0; 3 2.5,2.7
1X14 = drill 1.016 pad 1.88: 1 0,0; 2 2.54,0; 3 5.08,0; 4 7.62,0; 5 10.16,0; 6 12.7,0; 7 15.24,0; 8 17.78,0; 9 20.32,0; 10 22.86,0; 11 25.4,0; 12 27.94,0; 13 30.48,0; 14 33.02,0
1X01_LONGPAD = drill 1.118 pad 1.88 long: 1 0,0
2X3-NS = drill 1.016 pad 1.88: 1 -2.54,-1.27; 2 -2.54,1.27; 3 0,-1.27; 4 0,1.27; 5 2.54,-1.27; 6 2.54,1.27
RESC0805_L = smd 1 x 1.25: 1 -1,0; 2 1,0
SOT96P237X111-3N = smd 1.25 x 0.6: 1 -1.05,0.955; 2 -1.05,-0.955; 3 1.05,0
3.2X2.5_KXO-84 = smd 0.9 x 1.1: 1 -1.4,-0.9; 2 1.4,-0.9; 3 1.4,0.9; 4 -1.4,0.9
TQFP32-08 = smd 1.27 x 0.559: 1 -4.293,2.8; 2 -4.293,2; 3 -4.293,1.2; 4 -4.293,0.4; 5 -4.293,-0.4; 6 -4.293,-1.2; 7 -4.293,-2; 8 -4.293,-2.8; 17 4.293,-2.8; 18 4.293,-2; 19 4.293,-1.2; 20 4.293,-0.4; 21 4.293,0.4; 22 4.293,1.2; 23 4.293,2; 24 4.293,2.8 | smd 0.559 x 1.27: 9 -2.8,-4.293; 10 -2,-4.293; 11 -1.2,-4.293; 12 -0.4,-4.293; 13 0.4,-4.293; 14 1.2,-4.293; 15 2,-4.293; 16 2.8,-4.293; 25 2.8,4.293; 26 2,4.293; 27 1.2,4.293; 28 0.4,4.293; 29 -0.4,4.293; 30 -1.2,4.293; 31 -2,4.293; 32 -2.8,4.293
TO-252 = smd 1 x 1.6: 1 -2.28,-4.8; 2 2.28,-4.8 | smd 5.4 x 6.2: 3 0,2.5
MSOP10 = smd 0.25 x 1: 1 -1,-2.113; 2 -0.5,-2.113; 3 0,-2.113; 4 0.5,-2.113; 5 1,-2.113; 6 1,2.113; 7 0.5,2.113; 8 0,2.113; 9 -0.5,2.113; 10 -1,2.113
CRYSTAL-SMD-5X3.2-2PAD = smd 1.7 x 2.4: P$1 1.85,0; P$2 -1.85,0

### Placement (x,y rotation side)
C1  15.94,15.28 90 top
C2  11.35,15.24 90 top
C3  76.25,16.99 180 top
C4  75.72,21.12 180 top
C5  24.23,11.85 0 top
C6  24.21,30.59 0 top
C7  24.22,20.16 0 top
C8  24.2,25.38 0 top
C9  70.3,35.54 0 top
C10  69.26,39.3 0 top
C11  32.21,28.85 0 top
C12  32.88,11.84 0 top
C13  37.21,28.7 0 top
C14  37.07,11.81 0 top
C15  8.46,33.73 90 top
C16  56.32,21.93 180 top
C17  47.58,40.83 0 top
C18  47.2,23.16 270 top
C19  47.53,43.4 180 top
C20  51.64,40.88 0 top
C21  57.49,31.54 180 top
C22  57.5,33.41 0 top
C23  61.94,33.61 0 top
C24  57.41,35.73 180 top
C25  57.54,27.47 180 top
C26  57.51,40.04 0 top
C27  57.51,37.76 0 top
C28  7.72,28.99 0 top
C30  60.84,15.81 180 top
C44  18.12,29.76 180 top
C99  18.89,33.72 90 top
D1  9.71,38.94 270 top
H5  4.47,53.16 0 top
H6  83.54,53.25 0 top
H7  4.6,4.21 0 top
H8  83.54,4.23 0 top
IC2  13.03,20.66 0 top
IC3  63.24,19.82 180 top
IC4  34.85,20.67 90 top
J1  74.94,28.16 0 top
J2  73.89,3.72 180 top
J3  40.87,53.63 0 top
J4  6.58,22.26 0 top
J5  69.32,18.32 0 top
J6  19.66,23.28 90 top
J7  22.2,37.37 90 top
J8  74.27,46.52 0 top
J9  70.97,46.52 0 top
J10  26.17,51.46 180 top
J11  51.54,12.23 0 top
J12  55.09,12.23 0 top
J13  51.54,17.56 0 top
J14  62.97,37.88 0 top
J15  58.78,12.23 0 top
J16  12.17,50.07 0 top
J17  22.33,43.34 90 top
L1  69.44,42.2 180 top
L2  52.17,43.47 0 top
Q1  62,30.53 0 top
Q2  18.04,26.57 0 top
R1  13.65,15.24 270 top
R2  13.66,10.57 90 top
R3  11.36,10.46 90 top
R4  24.16,14.47 0 top
R5  24.18,17.16 0 top
R6  24.26,22.73 0 top
R7  24.18,27.87 0 top
R8  32.21,25.39 0 top
R9  32.88,15.24 0 top
R10  37.2,32.06 180 top
R11  37.2,25.32 0 top
R12  43.44,41.99 90 top
R13  37.09,15.22 0 top
R14  15.27,38.07 0 top
R15  11.36,33.71 270 top
R16  62,27.57 180 top
R17  37.86,41.95 270 top
R18  57.51,29.63 0 top
R19  40.75,41.95 90 top
R20  56.3,24.11 180 top
R21  57.5,42.47 180 top
R22  52.3,46.65 180 top
R23  32.99,8.29 180 top
R24  7.59,26.45 0 top
R25  63.35,24.17 180 top
R26  65.51,15.78 180 top
R27  13.94,27.98 270 top
R28  11.4,27.98 270 top
U1  48.52,33.13 90 top
U2  80.07,39.86 270 top
U10  15.08,33.69 180 top
Y1  51.41,23.53 90 top

### Tracks (layer width: path | path; a pad name or v marks a point on that pad's centre or on a via)
3V3  (via drill 0.35)
  Top 0.152: D1.2 8.46,37.84 8.46,36.49 | 8.46,36.49 C15.2 8.96,34.09 9.19,34.09 10.42,32.86 R15.2 | R14.2 16.08,38.04 U10.1 17.23,35.8 18.16,34.86 18.16,34.33 17.91,34.08 15.13,34.08 13.73,32.68 13.73,30.98 13.86,30.85 14.4,30.85 14.58,31.03 U10.7 14.58,32.6 15.29,33.31 17.5,33.31 17.75,33.06 17.75,30.24 C44.2 16.64,29.13 Q2.4 Q2.1 16.62,25.69 14.71,25.69 v14.07,25.06 | v9.37,36.49 8.46,36.49
  Bottom 0.152: v14.07,25.06 14.07,31.79 v9.37,36.49
5V
  Top 0.152: U2.2 73.74,37.58 C9.+ 71.7,37.71 C10.2 70.11,39.94 70.59,40.42 70.59,42.06 L1.1
+12V
  Top 0.406: U2.1 76.94,40.48 76.94,35.34 74.94,33.35 J1.1 74.87,28.09 C4.2 74.85,21.11 C3.+ 74.85,16.75 64.24,6.13 60.43,6.13 58.65,4.35 J2.7 J2.8 55.98,3.59 55.4,3.59 53.85,2.04 40.08,2.04 39.57,2.55 39.57,6.41 37.69,8.29 R23.1
AREF
  Top 0.152: J3.8 57.38,54.9 55.73,54.9 54.74,53.91 54.74,53.15 54.05,52.46 53.29,52.46 49.76,48.93 47.6,46.77 47.6,42.33 47.35,42.07 | U1.20 48.92,38.85 48.43,39.34 C17.2 48.51,40.91 47.35,42.07 | 47.35,42.07 45.57,42.07 44.8,42.84 R12.2 43.4,42.8 R19.2 39.9,41.95 37.31,41.95 37.31,41.93 37.13,41.75 37.13,40.46 37.26,40.32 38.33,40.32 38.74,39.91 38.74,39.21 39.85,38.09 39.85,38.01 39.49,37.65 38.71,37.65 36.97,35.91 36.97,32.67 R10.2
AUDIO  (via drill 0.35)
  Top 0.152: v61.06,35.34 60.43,35.34 59.92,34.83 59.92,34.07 59.25,33.41 C22.2
  Bottom 0.152: v61.06,35.34 61.06,14.39 60.93,14.39 J15.1 62.33,8.67 69.32,8.67 71.35,6.64 J2.2
AVCC
  Top 0.152: R21.2 55.65,43.47 L2.2 53.17,43.26 C20.1 50.52,40.6 U1.18
CLK0
  Top 0.152: J6.1 19.66,22.77 18.53,21.64 IC2.14 15.08,21.64 12.93,23.79 12.93,26.11 R27.2
CLK1
  Top 0.152: J4.1 6.61,22.29 IC2.2 10.9,22.29 11.4,22.8 R28.2
CLK2
  Top 0.152: R26.1 66.36,17.68 IC3.1 IC3.2 69.12,18.52 J5.1
DRIVE  (via drill 0.35)
  Top 0.152: R20.2 55.45,21.95 C16.2 v55.47,19.22 | J3.7 60.81,48.93 v60.81,44.49 | v55.47,19.21 v55.47,19.22 | J13.1 54.08,17.56 55.47,18.96 v55.47,19.22
  Bottom 0.152: v60.81,44.49 60.81,35.95 60.45,35.59 60.45,35.09 60.76,34.79 60.76,24.5 v55.47,19.21
GND  (via drill 0.35)
  other vias: 47.22,27.09 53.44,42.07 57.25,25.94 62.97,15.78 44.93,41.18 25.88,37.37 27.15,37.37 28.42,37.37 46.71,45.38 29.44,32.17 30.71,32.17 31.98,32.17 49.63,50.84 44.81,51.09 52.43,49.57 62.59,51.22 65.13,51.34 45.19,8.67 44.81,7.02 40.74,31.79 47.85,10.96 38.46,34.96 11.66,36.99
  pour Bottom: 1.4,56.88 86.94,56.88 86.94,0.42 1.4,0.42
  pour Top: 1.4,56.91 86.94,56.91 86.94,0.42 1.4,0.42
  pour Route2: 1.24,56.93 86.84,56.93 86.84,0.42 1.24,0.42
  pour Route15: 1.24,56.93 87.1,56.93 87.1,0.54 1.24,0.54
N$1
  Top 0.152: U1.7 50.52,26.86 49.98,26.33 49.98,23.11 Y1.P$2
N$2
  Top 0.152: U1.8 51.41,28.74 Y1.P$1
N$3
  Top 0.152: C23.2 62.79,30.79 Q1.3
N$4  (via drill 0.35)
  Top 0.152: R17.2 R19.1 40.75,38.69 42.99,36.45 | U1.25 43.51,35.93 42.99,36.45 | C26.2 v59.66,40.04 | v40.61,35.09 40.61,35.34 41.72,36.45 42.99,36.45
  Bottom 0.152: v59.66,40.04 55.73,40.04 52.35,36.66 52.35,33.19 50.64,31.48 45.7,31.48 43.29,33.89 41.59,33.89 40.61,34.87 v40.61,35.09
N$5
  Top 0.152: IC3.13 IC3.12 IC3.3
N$6  (via drill 0.35)
  Top 0.152: U1.14 54.46,34.33 v54.58,34.2 | v54.14,29.56 56.6,29.56 R18.1
  Bottom 0.152: v54.58,34.2 54.58,29.88 54.2,29.5 v54.14,29.56
N$7
  Top 0.152: R18.2 58.39,29.61 C25.1 58.39,25.34 R20.1
N$8
  Top 0.152: 19.19,32.57 C99.1 18.14,32.11 18.14,28.77 Q2.3
N$9
  Top 0.152: R4.1 23.38,14.4 23.38,14.39 | 23.38,14.39 C5.1 | IC2.10 19.07,19.04 21.06,17.05 21.06,15.02 21.69,14.39 23.38,14.39
N$10
  Top 0.152: C16.1 57.17,20.44 57.79,19.82 IC3.11
N$11  (via drill 0.35)
  Top 0.152: R22.2 51.45,43.75 L2.1 48.45,43.47 C19.1 48.38,45.35 v48.36,45.38 | 48.23,29.75 48.12,29.64 U1.4 48.12,25.47 48.23,25.36 48.23,22.79 C18.+ | U1.6 49.72,29.67 49.63,29.75 48.23,29.75 | 48.23,29.75 44.89,29.75 43.27,28.13 40.74,28.13 40.01,28.87 40.01,35.59 40.74,36.33 40.74,37.63 39.34,39.03 v39.34,40.04
  Bottom 0.152: v39.34,40.04 45.31,46.01 48.11,46.01 48.36,45.76 v48.36,45.38
N$12
  Top 0.152: R1.1 13.69,16.13 C1.2 15.96,16.16 IC2.9
N$13
  Top 0.152: R1.2 C2.1 R3.2 13.55,11.32 R2.2
N$14
  Top 0.152: IC2.11 22.9,19.69 C7.1 23.33,20.12 R5.1
N$15
  Top 0.152: IC2.12 16.98,20.34 17.23,20.59 20.89,20.59 23.03,22.73 R6.1 22.77,23.36 22.77,24.8 C8.1
N$16
  Top 0.152: C6.1 23.33,30.56 R7.1 23.11,27.87 22.45,27.21 22.45,22.64 20.8,20.99 IC2.13
N$17  (via drill 0.35)
  Top 0.152: IC4.5 31.28,22.57 v29.95,23.91 | v26.64,17.18 25.06,17.18 R5.2
  Bottom 0.152: v29.95,23.91 28.55,23.91 27.53,22.9 27.53,17.44 27.28,17.18 v26.64,17.18
N$18
  Top 0.152: R4.2 31.26,14.47 R9.1 | R9.1 C12.1 | IC4.2 35.97,20.03 35.53,19.59 35.53,17.94 34.01,16.42 32.61,16.42 32.03,15.83 R9.1
N$19
  Top 0.152: C11.1 R8.1 28.88,25.39 25.68,28.6 24.39,28.6 24.25,28.46 24.25,27.27 24.39,27.14 25.03,27.14 26.14,26.03 | R6.2 25.25,22.73 26.14,23.62 26.14,26.03 | IC4.6 32.2,21.36 30.8,21.36 26.14,26.03
N$20
  Top 0.152: R7.2 25.03,27.82 30.93,21.92 33.36,21.92 33.71,21.57 33.71,20.91 33.41,20.61 31.1,20.61 30.84,20.34 30.84,19.72 31.09,19.47 33.5,19.47 35.34,21.3 IC4.3
N$21
  Top 0.152: C13.1 36.22,28.85 C11.2 R8.2 33.06,24.61 34.14,23.53 34.14,20.86 33.31,20.03 IC4.7
N$22
  Top 0.152: IC4.1 33.93,15.24 | 33.93,15.24 R9.2 | C14.1 33.75,11.81 C12.2 33.73,15.04 33.93,15.24
N$23  (via drill 0.35)
  Top 0.406: R23.2 30.33,8.29 v29.95,8.67 | v32.23,17.44 32.25,17.46 IC4.8
  Bottom 0.406: v29.95,8.67 29.95,15.15 v32.23,17.44
N$24  (via drill 0.35)
  Top 0.152: 8.57,26.33 R24.2 8.57,26.58 C28.2 | 8.57,26.33 8.57,24.48 IC2.1 8.49,22.94 7.06,24.37 6.09,24.37 5.41,23.69 5.41,15.89 10.77,10.54 12.84,10.54 R2.1 | IC2.16 15.96,23.9 v15.98,23.91 | v10.01,26.33 8.57,26.33
  Bottom 0.152: v10.01,26.33 12.42,23.91 v15.98,23.91
N$25
  Top 0.152: IC3.9 | IC3.9 IC3.10 | IC3.10 IC3.5 IC3.4 | R25.2 61.7,23.37 61.7,21.37 61.44,21.12 IC3.9 | C30.2 59.99,17.55 IC3.14 60.24,17.94 59.24,17.94 56.39,20.79 56.39,22.52 56.52,22.66 57.81,22.66 57.95,22.52 57.95,21.34 57.73,21.12 57.63,21.12 57.51,20.99 57.51,20.53 57.91,20.13 59.05,20.13 59.4,20.47 IC3.10
N$26
  Top 0.152: R27.1 14.58,28.83 16.08,30.33 U10.10
N$27
  Top 0.152: R28.1 12.33,29.75 15.08,29.75 15.58,30.26 15.58,31.01 15.58,31.53 U10.9
N$28
  Top 0.152: U10.6 14.08,32.56 15.21,33.69 17.25,33.69 34.14,33.69 35.58,32.25 35.58,31.46 35.71,31.33 37,31.33 37.28,31.6 37.28,35.74 38.89,37.35 39.98,37.35 40.33,36.99 40.33,36.49 39.63,35.78 39.63,23.12 47.73,15.02 64.24,15.02 64.66,15.44 R26.2
PB0_ICP
  Top 0.152: U1.12 54.41,32.73 55.6,31.54 C21.2 56.97,31.54 57.69,32.27 59.16,32.27 59.69,32.27 60.48,31.48 Q1.1
PB1_OC1A
  Top 0.152: C22.1 56.53,33.53 U1.13
PB3_MOSI  (via drill 0.35)
  Top 0.152: C24.2 55.96,35.13 U1.15 52.23,35.13 50.54,33.44 46.93,33.44 v46.68,33.69 | J10.4 27.54,51.57 29.19,51.57 29.88,52.25 29.88,53.44 30.96,54.52 36.68,54.52 39.6,51.6 43.92,51.6 J3.3
  Bottom 0.152: J10.4 26.17,47.76 37.31,36.61 38.15,36.61 40.23,38.7 41.71,38.7 42.01,39 42.52,39 42.87,38.64 42.87,38.16 43.06,37.98 43.28,37.98 43.63,37.63 43.63,37.12 43.41,36.9 43.41,36.49 46.2,33.69 v46.68,33.69
PB4_MISO  (via drill 0.35)
  Top 0.152: R21.1 58.35,41.73 56.83,40.21 C26.1 | J10.1 30.88,54.9 47.22,54.9 J3.4 | v48.45,34.04 48.58,33.92 50.38,33.92 51.66,35.2 51.66,35.6 51.92,35.85 52.73,35.85 U1.16 52.81,36.98 53.37,37.54 53.37,38.19 55.35,40.17 56.53,40.17 C26.1 | C27.1 C26.1
  Bottom 0.152: v48.45,34.04 48.52,33.97 50.14,33.97 50.75,34.58 50.75,51.37 J3.4
PB5_SCK  (via drill 0.35)
  Top 0.152: U1.17 51.32,36.52 v49.89,35.09
  Bottom 0.152: J3.5 49.76,54.9 44.68,54.9 | 44.68,54.9 28.3,54.9 26.17,52.77 J10.3 | v49.89,35.09 49.89,47.15 44.68,52.36 44.68,54.9
PC0_ADC0  (via drill 0.35)
  Top 0.152: v45.19,39.79 45.44,39.79 46.52,38.71 U1.23 46.48,37.38 46.48,36.82 46.15,36.49 43.92,36.49 v43.03,37.37 | v39.73,36.74 38.71,36.74 38.07,36.1 38.05,36.08 37.58,35.61 37.58,32.53 R10.1 C13.2 38.06,25.34 R11.2 39.32,24.05 39.32,23 47.6,14.72 52.6,14.72 J12.1
  Bottom 0.152: J3.9 51.13,43.57 51.13,34.2 50.01,33.08 46.33,33.08 42.6,36.82 | 42.6,36.82 42.42,36.99 39.98,36.99 v39.73,36.74 | v43.03,37.37 42.77,37.37 42.6,37.2 42.6,36.82
PC1_ADC1  (via drill 0.35)
  Top 0.152: v38.33,23.66 38.83,23.16 38.83,16.11 R13.2 37.92,15.2 C14.2 51.12,11.81 J11.1 | U1.24 45.42,37.12 43.79,37.12 43.63,37.28 43.63,37.63 43.28,37.98 42.67,37.98 v42.27,38.39 42.52,38.39 43.44,39.31 R12.1
  Bottom 0.152: v38.33,23.66 38.33,32.8 40.01,34.48 40.01,35.34 40.36,35.7 40.56,35.7 40.99,36.13 | v42.27,38.39 40.36,38.39 38.96,36.99 38.96,36.39 39.22,36.13 40.99,36.13 | J3.10 51.43,41.33 51.43,34.08 49.88,32.53 46.33,32.53 42.17,36.69 41.55,36.69 40.99,36.13
PC3_ADC3  (via drill 0.35)
  Top 0.152: v41.97,35.78 42.62,35.13 U1.26
  Bottom 0.152: J3.11 51.74,39.1 51.74,33.44 50.39,32.09 45.95,32.09 42.27,35.78 v41.97,35.78
PC4_SDA  (via drill 0.35)
  Top 0.152: R15.1 14.08,35.58 U10.5 14.08,37.03 13.64,37.48 13.64,40.21 14.46,41.03 14.96,41.03 15.56,40.42 34.14,40.42 37.13,43.41 37.13,43.45 37.26,43.58 37.29,43.58 37.33,43.62 42.92,43.62 46.58,47.28 47.68,47.28 52.3,51.9 52.3,54.39 53.11,55.21 67.23,55.21 J3.12 | v42.01,34.58 42.27,34.33 U1.27
  Bottom 0.152: v42.01,34.58 42.27,34.33 43.29,34.33 45.83,31.79 50.52,31.79 52.04,33.32 52.04,36.86 J3.12 68.81,48.68 J9.1
PC5_SCL  (via drill 0.35)
  Top 0.152: U10.4 14.58,37.91 14.47,38.02 | 14.47,38.02 R14.1 | v40.74,33.06 41.47,33.78 43.97,33.78 U1.28 45.02,33.53 45.19,33.69 45.19,35.47 45.44,35.72 49,35.72 49.28,35.44 49.28,34.71 49.63,34.35 50.14,34.35 50.55,34.77 50.55,35.16 53.06,37.67 53.06,38.39 55.47,40.8 56.87,40.8 57.51,41.44 57.51,43 57.97,43.47 61.82,43.47 71.35,53 J3.13 | v14.71,40.42 14.47,40.18 14.47,38.02
  Bottom 0.152: v14.71,40.42 15.98,41.69 28.17,41.69 37.34,32.52 37.34,23.15 37.82,22.67 38.83,22.67 39.32,23.15 39.32,32.09 40.28,33.06 v40.74,33.06 | J8.1 71.35,49.44 J3.13
PC6_RESET  (via drill 0.35)
  Top 0.152: v46.71,35.09 45.82,35.09 45.57,34.83 45.57,33.06 45.24,32.73 U1.29 42.32,32.73 v42.01,33.04
  Bottom 0.152: J3.2 43.41,51.47 49.25,45.63 49.25,37.63 v46.71,35.09 | v42.01,33.04 41.87,33.04 40.74,34.17 40.24,34.17 38.84,32.77 38.84,24.01 38.94,23.91 38.94,23.41 38.58,23.05 38.08,23.05 37.72,23.41 37.72,23.91 37.95,24.14 37.95,32.8 38.02,32.88 38.02,32.93 39.7,34.61 39.7,35.22 38.61,36.31 37.11,36.31 25.76,47.66 25.76,48.96 24.87,49.84 24.87,51.47 23.63,52.71 J10.5
PD0_RXD  (via drill 0.35)
  Top 0.152: U1.30 44.21,31.91 42.14,31.91 v42.01,31.79
  Bottom 0.152: J2.3 66.83,1.74 39.93,1.74 39.22,2.45 39.22,4.48 40.55,5.81 40.55,30.33 v42.01,31.79
PD1_TXD  (via drill 0.35)
  Top 0.152: U1.31 42.62,31.13 v42.01,30.52
  Bottom 0.152: J2.4 64.59,2.04 43.18,2.04 42.14,3.08 42.14,4.74 40.87,6.01 40.87,29.37 v42.01,30.52
PD2_INT0  (via drill 0.35)
  Top 0.152: U1.32 43.22,30.33 v42.01,29.12
  Bottom 0.152: v42.01,29.12 42.01,28.74 41.5,28.23 41.5,8.16 44.68,4.99 44.68,3.08 45.31,2.45 62.46,2.45 J2.5
PD3_INT1  (via drill 0.35)
  Top 0.152: U1.1 45.72,18.81 46.58,17.94 v47.35,17.94
  Bottom 0.152: v47.35,17.94 47.35,12.86 52.81,7.4 58.01,7.4 61.19,4.23 J2.6
PD4_XCK  (via drill 0.35)
  Top 0.152: U1.2 46.52,27.87 46.04,27.39 46.04,19.37 v46.58,18.83
  Bottom 0.152: v46.58,18.83 46.58,10.7 J2.9
PD5_T1  (via drill 0.35)
  Top 0.152: U1.9 50.71,30.33 v50.27,30.77
  Bottom 0.152: v50.27,30.77 49.38,30.77 44.68,26.07 44.68,10.07 J2.10
PD6_AIN0  (via drill 0.35)
  Top 0.152: U1.10 51.92,31.13 51.29,31.76 49.19,31.76 v48.18,30.75
  Bottom 0.152: J2.11 48.49,4.35 43.41,9.43 43.41,25.98 v48.18,30.75
PD7_AIN1  (via drill 0.35)
  Top 0.152: U1.11 51.92,31.93 51.67,32.18 47.49,32.18 v46.08,30.77
  Bottom 0.152: v46.08,30.77 42.14,26.83 42.14,8.8 45.95,4.99 J2.12
RX_RF
  Top 0.152: J14.1 62.97,35.49 C23.1 61.09,32.59 61.93,31.75 61.93,26.98 61.45,26.51 61.45,26.2 62.29,25.36 68.17,25.36 71.65,21.88 71.65,15.66 65,9 48.69,9 J2.13
TO_FST
  Top 0.152: Q1.2 61.15,29.37 R16.2 61.15,25.99 62.08,25.06 68.05,25.06 71.35,21.75 71.35,15.78 64.87,9.31 18.14,9.31 15.94,11.51 C1.1
VCC  (via drill 0.35)
  Top 0.152: v68.94,26.83 70.21,28.1 70.21,37.5 69.18,38.52 69.18,39.9 68.44,40.64 L1.2 68.44,49.66 71.25,52.46 71.83,52.46 72.52,53.15 72.52,54.11 71.83,54.8 70.86,54.8 70.18,54.11 70.18,52.26 61.8,43.88 60.56,43.88 60.2,44.24 60.2,45.73 v55.35,50.58 53.15,48.38 R22.1 | J10.2 28.71,49.35 27.41,48.04 16.77,48.04 D1.1 6.93,39.89 4.8,37.76 4.8,26.75 5.09,26.45 R24.1 | R25.1 v67.28,24.17
  Bottom 0.152: J10.2 28.68,50.19 27.31,51.57 25.69,51.57 25,52.25 25,53.22 25.69,53.9 26.87,53.9 28.17,55.2 28.17,55.21 51.11,55.21 52.68,53.63 J3.6 53.57,52.36 v55.35,50.58 | v68.94,26.83 68.05,25.94 68.05,24.93 v67.28,24.17
XA
  Top 0.152: 15.34,38.67 15.34,37.48 15.58,37.23 U10.2 | 15.34,38.67 15.47,38.8 16.76,38.8 16.89,38.67 16.89,36.56 C99.2 | 15.34,38.67 15.34,39.78 15.67,40.12 19.46,40.12 J7.1
XB
  Top 0.152: U10.3 15.06,35.78 15.06,35.33 14.8,35.07 13.58,35.07 13.35,34.98 12.31,34.59 12.29,34.58 12.29,32.42 11.96,32.09 10.77,32.09 9.07,33.79 7.89,33.79 7.68,33.99 7.68,38.58 7.82,38.71 9.41,38.71 10.11,38.01 12.87,38.01 13.33,38.47 13.33,40.34 14.33,41.33 17.4,41.33 19.41,43.34 J17.1

### Text on the board
tPlace: +
tNames: SCK | MISO | RST | GND | RST | SDA | SCL | GND | MOSI | SCK | VCC | AREF | ADC0 | ADC1 | ADC3 | GND | VCC | MISO | DRIVE | MOSI | RX_RF | AUDIO | GND | AIN1 | AIN0 | T1 | XCK | +12V | +12V | INT1 | INT0 | TXD | RXD | GND
bNames: RST | MOSI | MISO | SCK | VCC | DRIVE | AREF | ADC0 | ADC1 | ADC3 | GND | SDA | SCL | GND | GND | SDA | SCL | XB | RX_RF | XA | CLK1 | CLK0 | CLK2 | ADC1 | ADC0 | K1FM | AUDIO | DRIVE | Replacement for the / DL2MAN uSDX Main Board / v2.4 | GND | RX_RF | AIN1 | AIN0 | T1 | XCK | +12V | +12V | INT1 | INT0 | TXD | RXD | AUDIO | GND